# Altium schematic sheet Devel-AirScoutSchematics.SchDoc
size A2; SheetNumber: 1; SheetTotal: 2
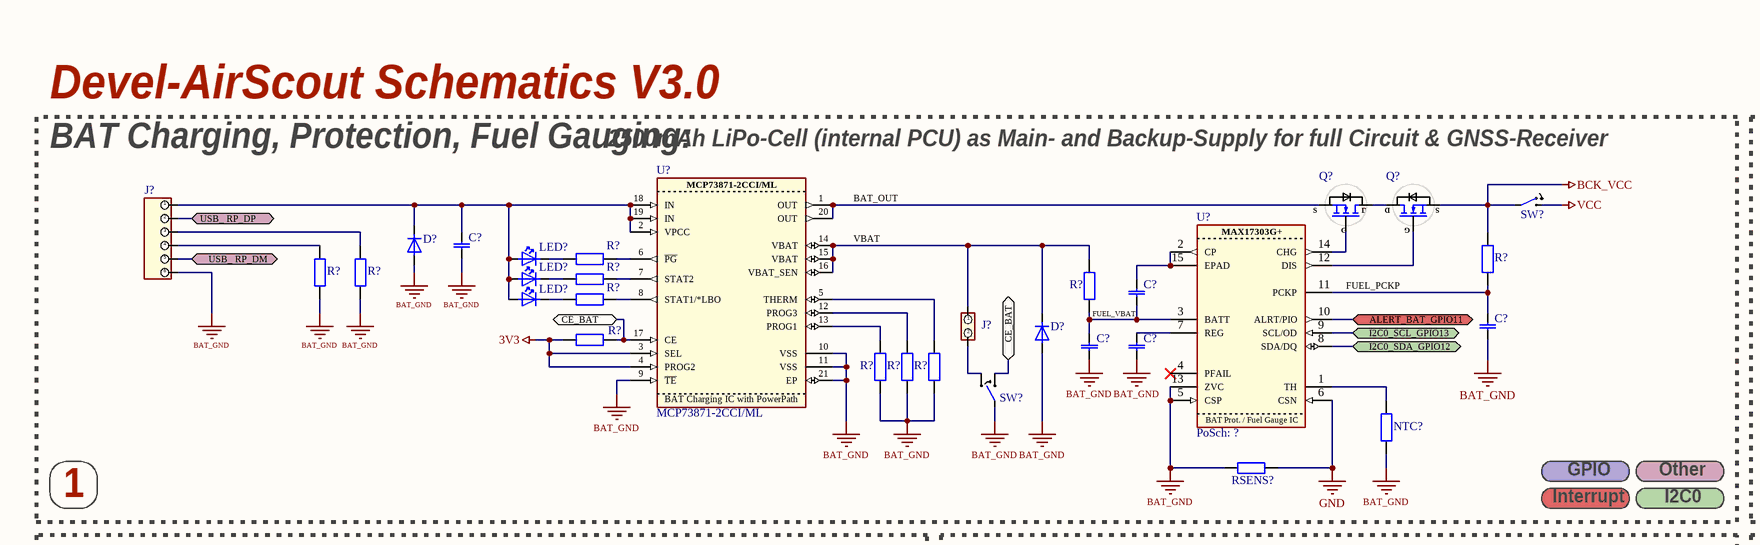
[diagram p0: Devel-AirScoutSchematics.SchDoc, top left]
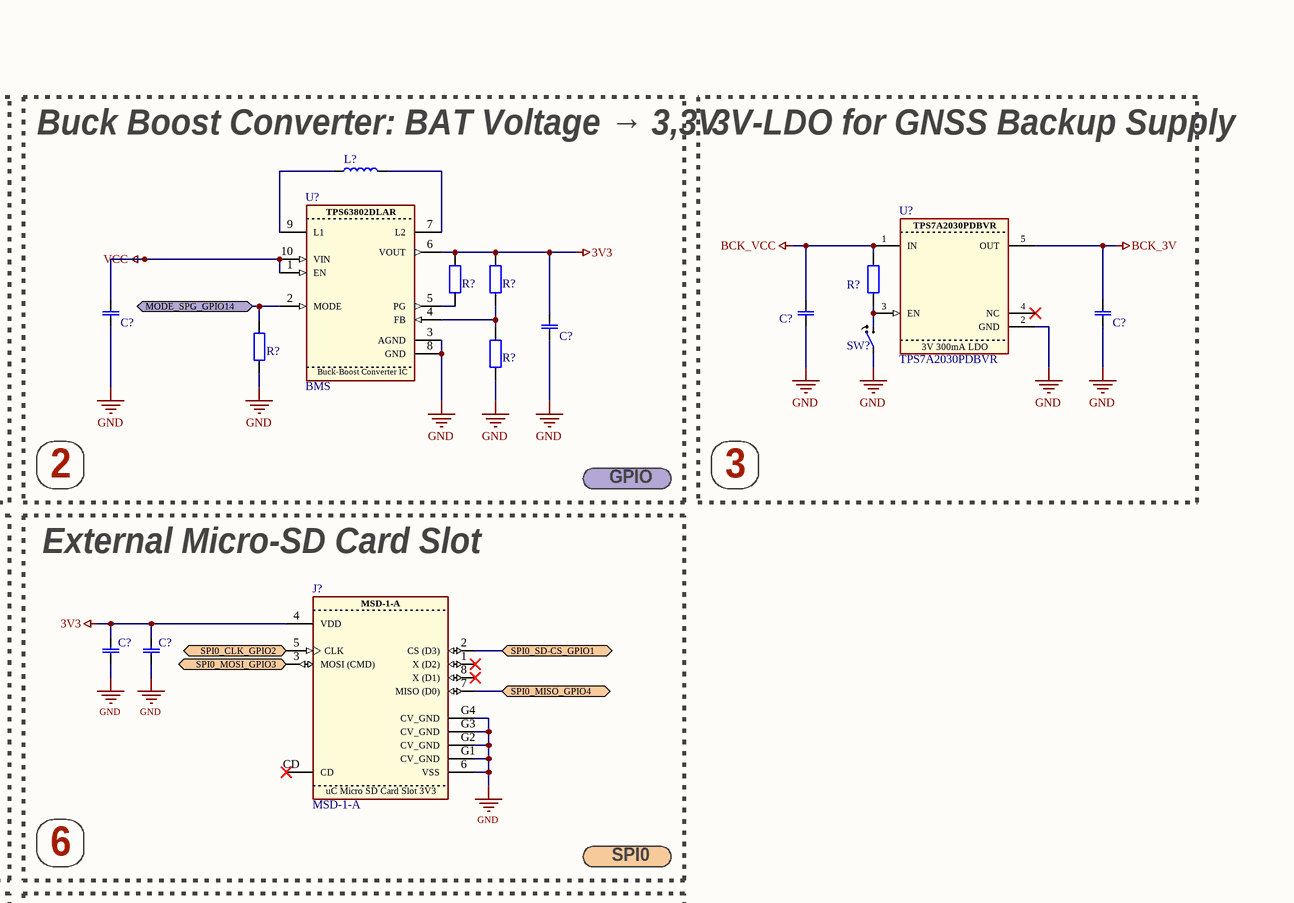
[diagram p1: Devel-AirScoutSchematics.SchDoc, top middle]
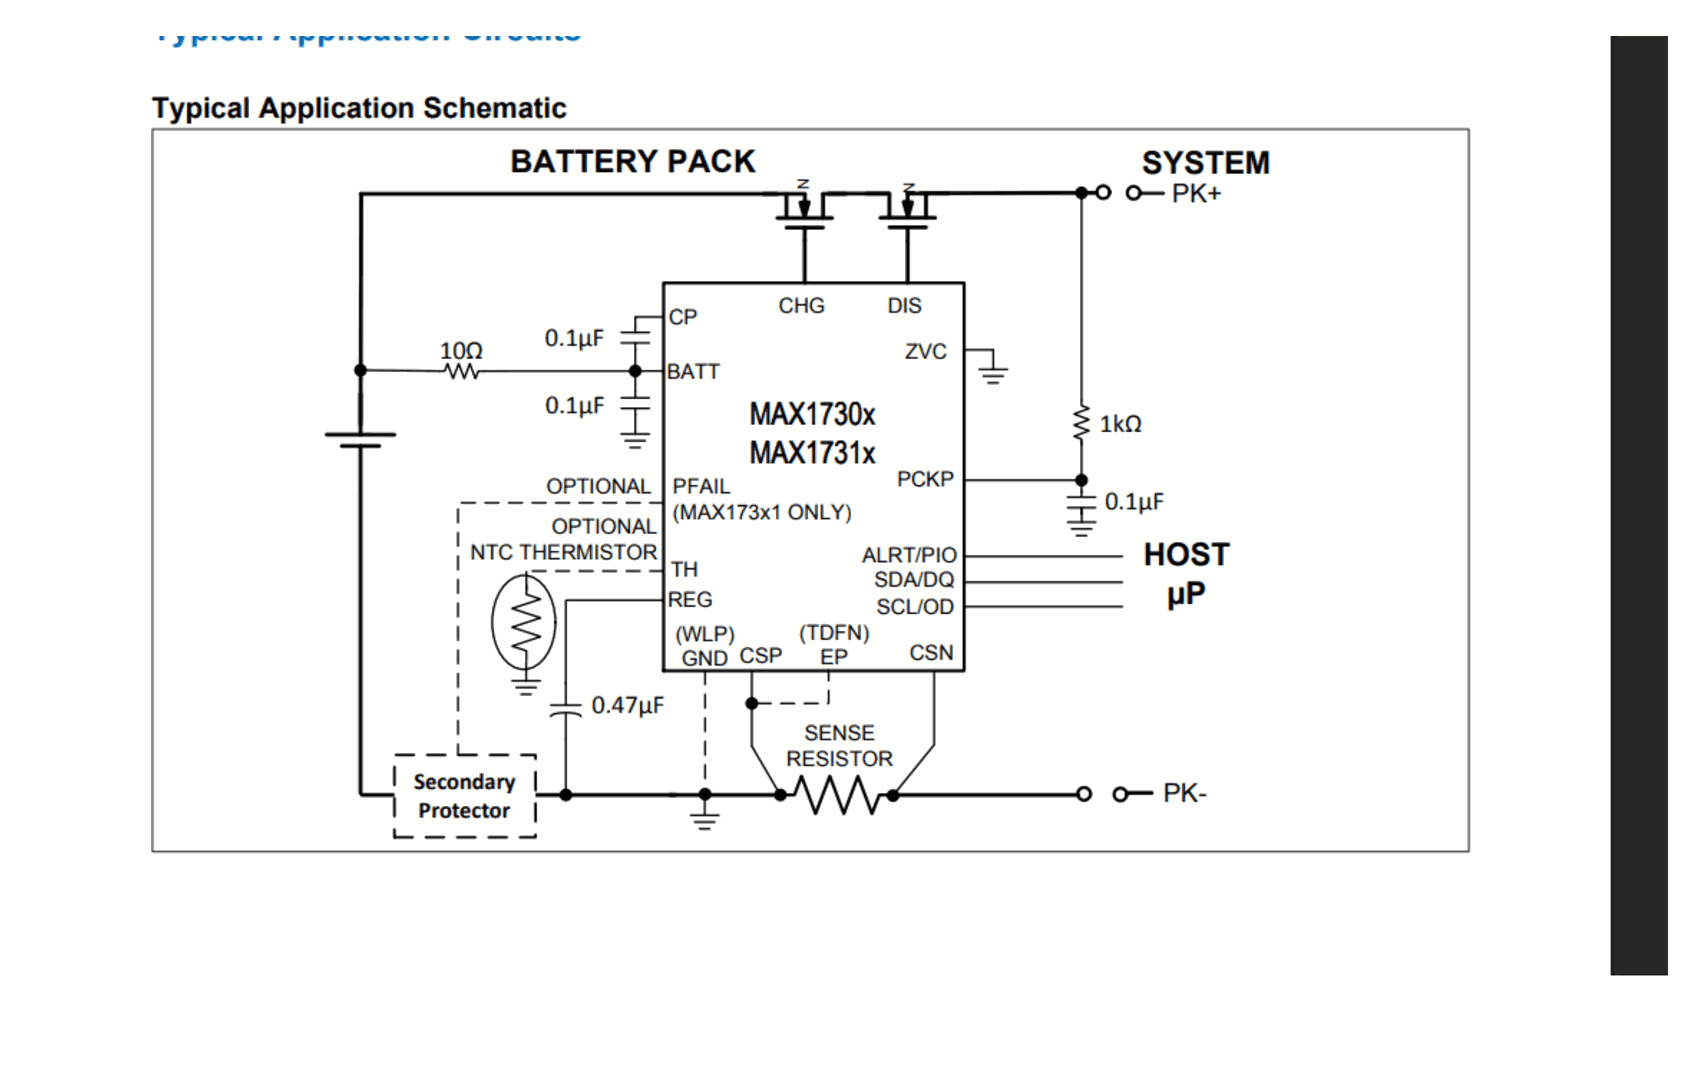
[diagram p2: Devel-AirScoutSchematics.SchDoc, top right]
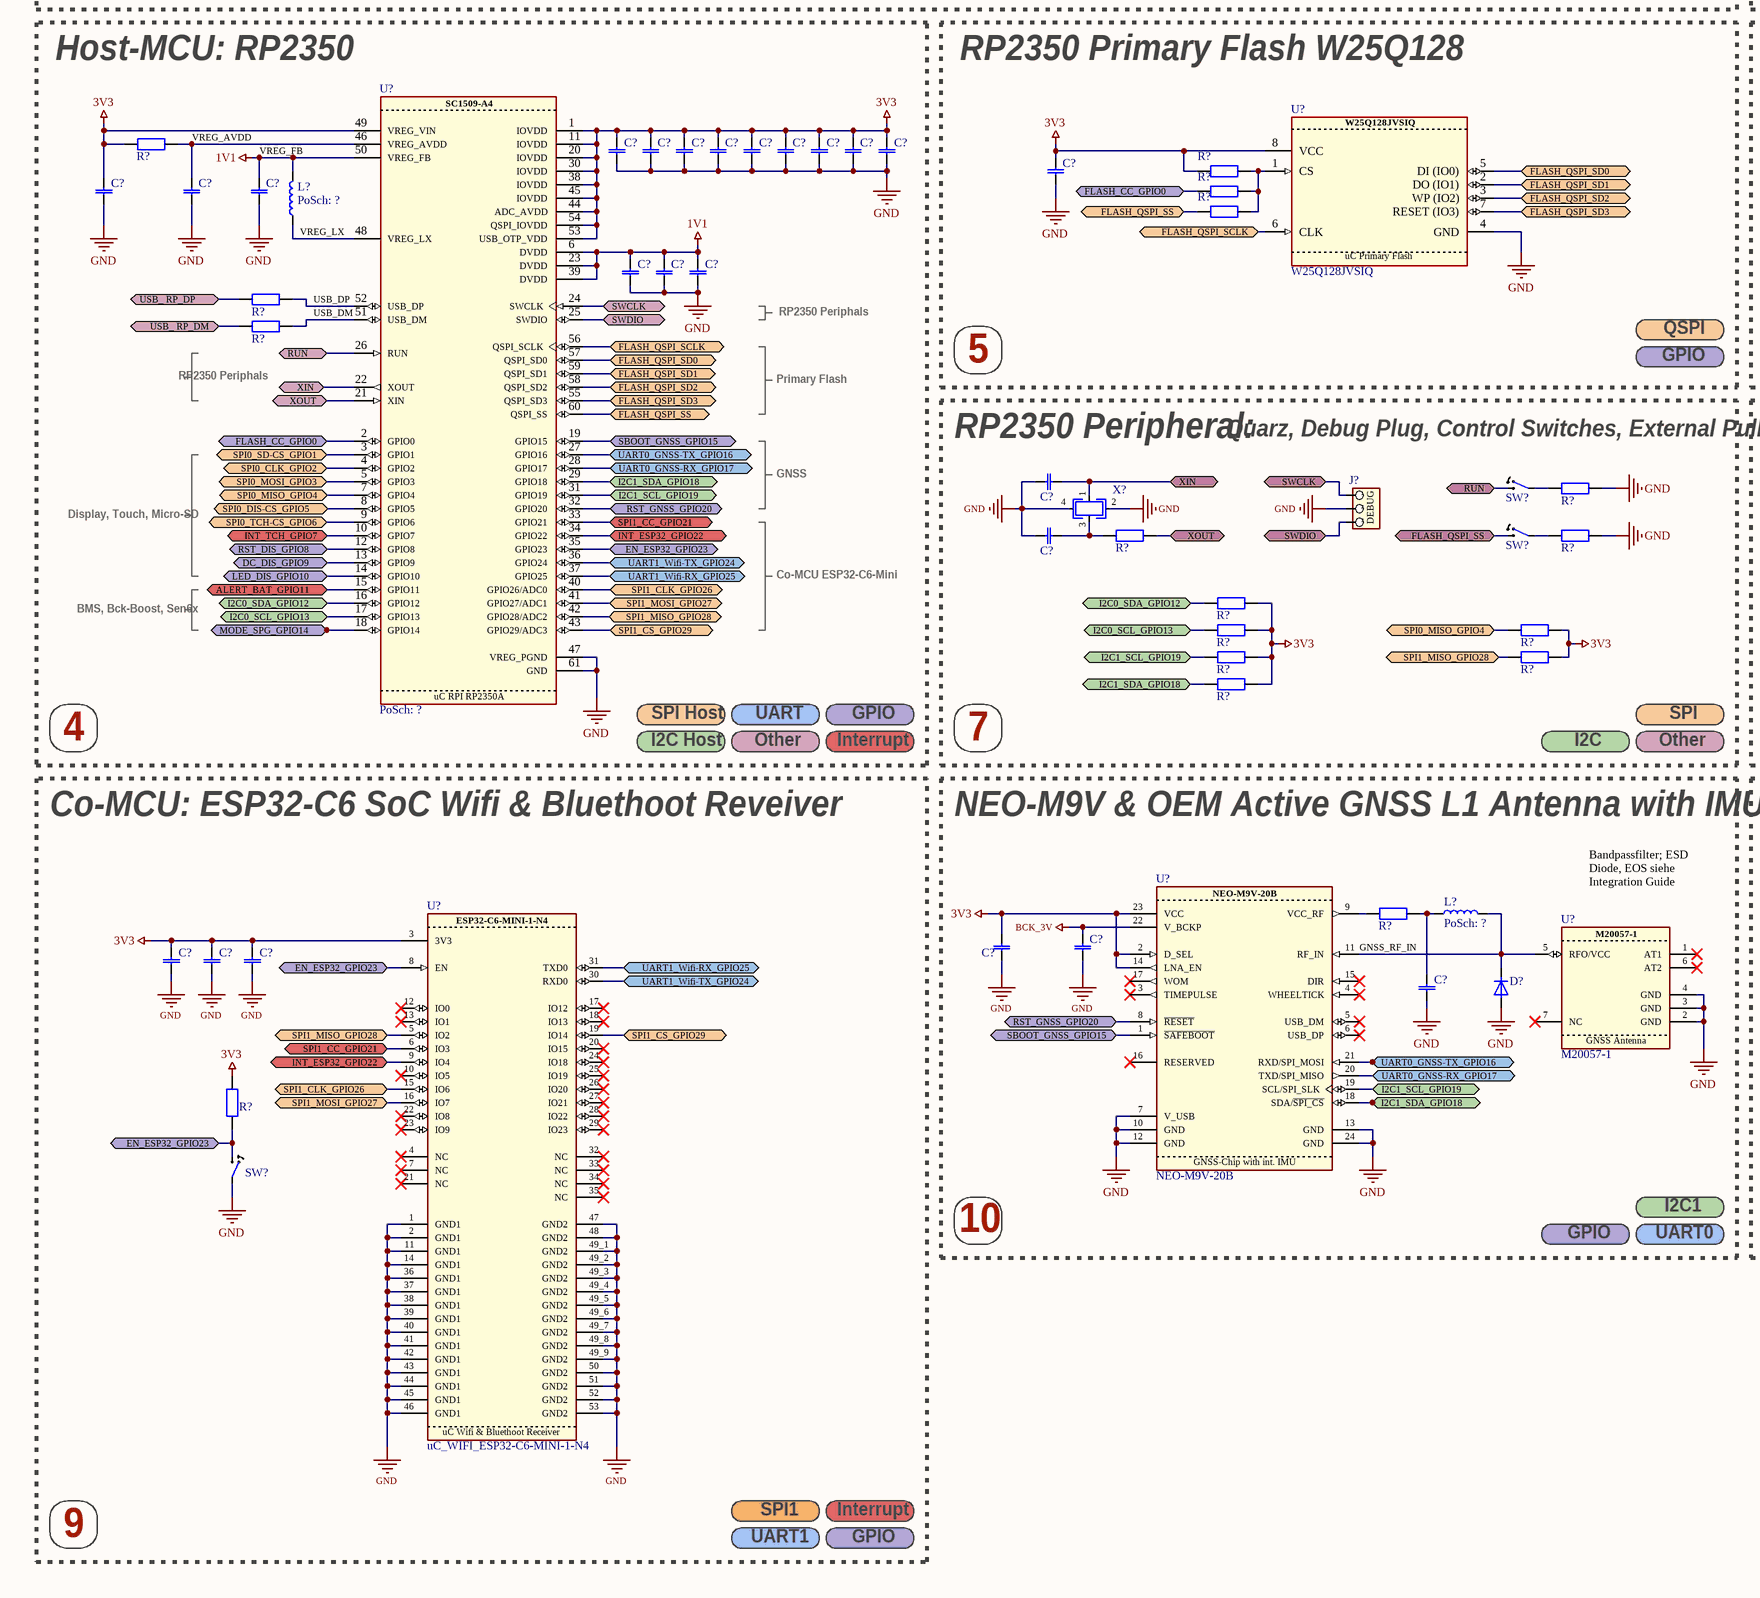
[diagram p3: Devel-AirScoutSchematics.SchDoc, bottom left]
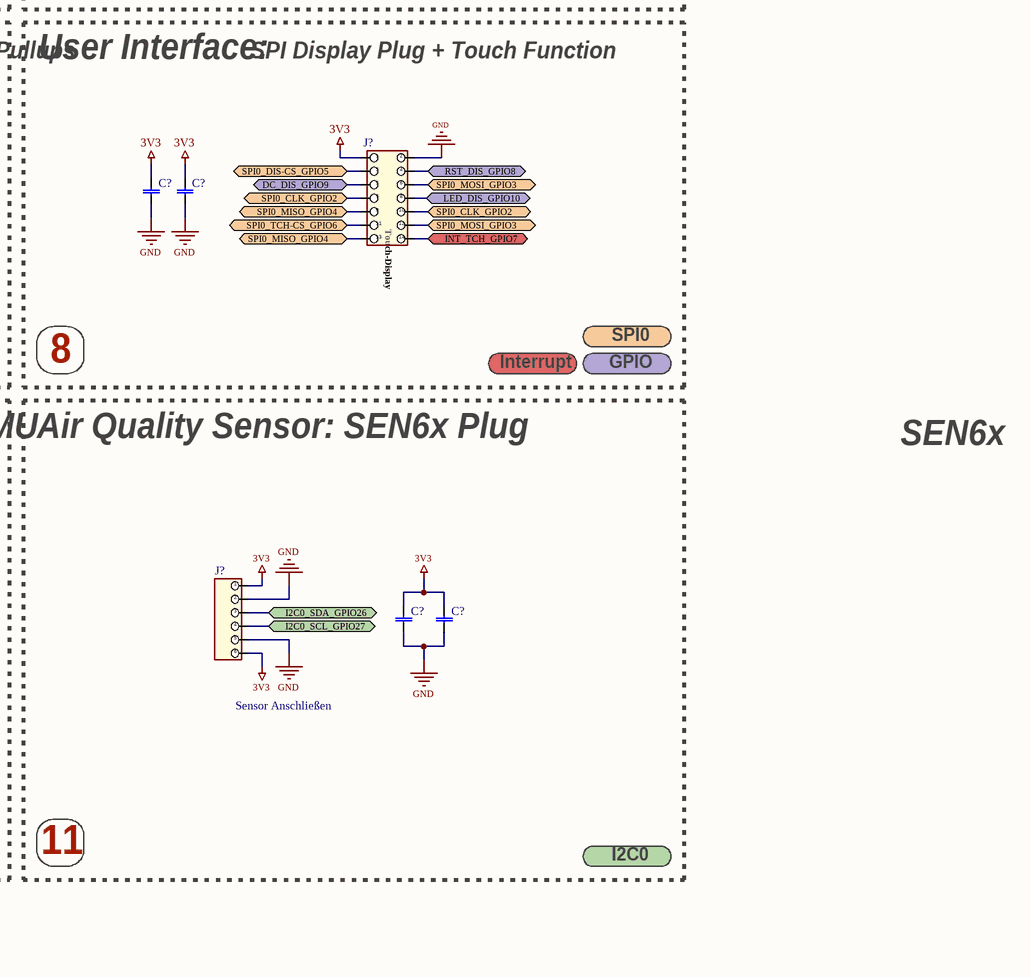
[diagram p4: Devel-AirScoutSchematics.SchDoc, bottom middle]

## Parts
(Parts that share a designator on the sheet are numbered #1, #2 ... from top to bottom, then left to right.)
C?#1  Capacitor with no polarity  [CAPC340180_140N_KEM]  (value not drawn)
C?#2  Capacitor with no polarity  [CAPC340180_140N_KEM]  (value not drawn)
C?#3  Capacitor with no polarity  [CAPC340180_140N_KEM]  (value not drawn)
C?#4  Capacitor with no polarity  [CAPC340180_140N_KEM]  (value not drawn)
C?#5  Capacitor with no polarity  [CAPC340180_140N_KEM]  (value not drawn)
C?#6  Capacitor with no polarity  [CAPC340180_140N_KEM]  (value not drawn)
C?#7  Capacitor with no polarity  [CAPC340180_140N_KEM]  (value not drawn)
C?#8  Capacitor with no polarity  [CAPC340180_140N_KEM]  (value not drawn)
C?#9  Capacitor with no polarity  [CAPC340180_140N_KEM]  (value not drawn)
C?#10  Capacitor with no polarity  [CAPC340180_140N_KEM]  (value not drawn)
C?#11  Capacitor with no polarity  [CAPC340180_140N_KEM]  (value not drawn)
C?#12  Capacitor with no polarity  [CAPC340180_140N_KEM]  (value not drawn)
C?#13  Capacitor with no polarity  [CAPC340180_140N_KEM]  (value not drawn)
C?#14  Capacitor with no polarity  [CAPC340180_140N_KEM]  (value not drawn)
C?#15  Capacitor with no polarity  [CAPC340180_140N_KEM]  (value not drawn)
C?#16  Capacitor with no polarity  [CAPC340180_140N_KEM]  (value not drawn)
C?#17  Capacitor with no polarity  [CAPC340180_140N_KEM]  (value not drawn)
C?#18  Capacitor with no polarity  [CAPC340180_140N_KEM]  (value not drawn)
C?#19  Capacitor with no polarity  [CAPC340180_140N_KEM]  (value not drawn)
C?#20  Capacitor with no polarity  [CAPC340180_140N_KEM]  (value not drawn)
C?#21  Capacitor with no polarity  [CAPC340180_140N_KEM]  (value not drawn)
C?#22  Capacitor with no polarity  [CAPC340180_140N_KEM]  (value not drawn)
C?#23  Capacitor with no polarity  [CAPC340180_140N_KEM]  (value not drawn)
C?#24  Capacitor with no polarity  [CAPC340180_140N_KEM]  (value not drawn)
C?#25  Capacitor with no polarity  [CAPC340180_140N_KEM]  (value not drawn)
C?#26  Capacitor with no polarity  [CAPC340180_140N_KEM]  (value not drawn)
C?#27  Capacitor with no polarity  [CAPC340180_140N_KEM]  (value not drawn)
C?#28  Capacitor with no polarity  [CAPC340180_140N_KEM]  (value not drawn)
C?#29  Capacitor with no polarity  [CAPC340180_140N_KEM]  (value not drawn)
C?#30  Capacitor with no polarity  [CAPC340180_140N_KEM]  (value not drawn)
C?#31  Capacitor with no polarity  [CAPC340180_140N_KEM]  (value not drawn)
C?#32  Capacitor with no polarity  [CAPC340180_140N_KEM]  (value not drawn)
C?#33  Capacitor with no polarity  [CAPC340180_140N_KEM]  (value not drawn)
C?#34  Capacitor with no polarity  [CAPC340180_140N_KEM]  (value not drawn)
C?#35  Capacitor with no polarity  [CAPC340180_140N_KEM]  (value not drawn)
C?#36  Capacitor with no polarity  [CAPC340180_140N_KEM]  (value not drawn)
C?#37  Capacitor with no polarity  [CAPC340180_140N_KEM]  (value not drawn)
C?#38  Capacitor with no polarity  [CAPC340180_140N_KEM]  (value not drawn)
C?#39  Capacitor with no polarity  [CAPC340180_140N_KEM]  (value not drawn)
D?#1  Diode; PN  (value not drawn)
D?#2  Diode; PN  (value not drawn)
D?#3  Diode; PN  (value not drawn)
J?#1  6 Plug in 1 Row  [JST_B6B-PH-K-S]  (value not drawn)
J?#2  PoSch: BMS  (value not drawn)
J?#3  MSD-1-A  [uC_MICROSDCON_MSD-1-A]
J?#4  3x1 vertical Connector Box  [CONN_3POL_SAMTEC]  (value not drawn)
J?#5  7 Plugs in 2 Rows  [CONN_14POL_SAMTEC]  (value not drawn)
J?#6  6 Plug in 1 Row  [JST_B6B-PH-K-S]  (value not drawn)
L?#1  PoSch: BMS  [IND_FDSD0420-H-100M=P3]  (value not drawn)
L?#2  PoSch: ?  [IND_FDSD0420-H-100M=P3]
L?#3  PoSch: ?  [IND_FDSD0420-H-100M=P3]
LED?#1  various color  [LED_LTST-C150GKT_LTO]  (value not drawn)
LED?#2  various color  [LED_LTST-C150GKT_LTO]  (value not drawn)
LED?#3  various color  [LED_LTST-C150GKT_LTO]  (value not drawn)
NTC?  Resistor of any value  [RESC3116X65N]  (value not drawn)
Q?#1  PoSch: BMS  (value not drawn)
Q?#2  PoSch: BMS  (value not drawn)
R?#1  Resistor of any value  [RESC3116X65N]  (value not drawn)
R?#2  Resistor of any value  [RESC3116X65N]  (value not drawn)
R?#3  Resistor of any value  [RESC3116X65N]  (value not drawn)
R?#4  Resistor of any value  [RESC3116X65N]  (value not drawn)
R?#5  Resistor of any value  [RESC3116X65N]  (value not drawn)
R?#6  Resistor of any value  [RESC3116X65N]  (value not drawn)
R?#7  Resistor of any value  [RESC3116X65N]  (value not drawn)
R?#8  Resistor of any value  [RESC3116X65N]  (value not drawn)
R?#9  Resistor of any value  [RESC3116X65N]  (value not drawn)
R?#10  Resistor of any value  [RESC3116X65N]  (value not drawn)
R?#11  Resistor of any value  [RESC3116X65N]  (value not drawn)
R?#12  Resistor of any value  [RESC3116X65N]  (value not drawn)
R?#13  Resistor of any value  [RESC3116X65N]  (value not drawn)
R?#14  Resistor of any value  [RESC3116X65N]  (value not drawn)
R?#15  Resistor of any value  [RESC3116X65N]  (value not drawn)
R?#16  Resistor of any value  [RESC3116X65N]  (value not drawn)
R?#17  RES, Resistor of any value  [RESC3116X65N]  (value not drawn)
R?#18  RES, Resistor of any value  [RESC3116X65N]  (value not drawn)
R?#19  RES, Resistor of any value  [RESC3116X65N]  (value not drawn)
R?#20  RES, Resistor of any value  [RESC3116X65N]  (value not drawn)
R?#21  RES, Resistor of any value  [RESC3116X65N]  (value not drawn)
R?#22  RES, Resistor of any value  [RESC3116X65N]  (value not drawn)
R?#23  RES, Resistor of any value  [RESC3116X65N]  (value not drawn)
R?#24  RES, Resistor of any value  [RESC3116X65N]  (value not drawn)
R?#25  RES, Resistor of any value  [RESC3116X65N]  (value not drawn)
R?#26  RES, Resistor of any value  [RESC3116X65N]  (value not drawn)
R?#27  RES, Resistor of any value  [RESC3116X65N]  (value not drawn)
R?#28  RES, Resistor of any value  [RESC3116X65N]  (value not drawn)
R?#29  RES, Resistor of any value  [RESC3116X65N]  (value not drawn)
R?#30  RES, Resistor of any value  [RESC3116X65N]  (value not drawn)
R?#31  RES, Resistor of any value  [RESC3116X65N]  (value not drawn)
R?#32  RES, Resistor of any value  [RESC3116X65N]  (value not drawn)
R?#33  RES, Resistor of any value  [RESC3116X65N]  (value not drawn)
RSENS?  Resistor of any value  [RESC3116X65N]  (value not drawn)
SW?#1  PoSch: ?  (value not drawn)
SW?#2  PoSch: ?  (value not drawn)
SW?#3  PoSch: ?  [SWITCH_2POS]  (value not drawn)
SW?#4  PoSch: ?  (value not drawn)
SW?#5  PoSch: ?  (value not drawn)
SW?#6  PoSch: ?  (value not drawn)
U?#1  PoSch: ?  [21-0137I_T1433-2_MXM]
U?#2  MCP73871-2CCI/ML  [BAT_LIN-CHARGE_MCP73871-2CCI/ML]
U?#3  BMS  [SPG_BCKBOOST_TPS63802DLAR]
U?#4  TPS7A2030PDBVR  [SPG_3V-LDO_TPS7A2030PDBVR]
U?#5  W25Q128JVSIQ  [uC_PRIMFLASH16MB_W25Q128JVSIQ]
U?#6  PoSch: ?  [uC_RP2350A_SC1509-A4_1]
U?#7  M20057-1  [GNSS_ANTENNA-MODULE_M20057-1]
U?#8  NEO-M9V-20B  [GNSS_RECEIVER-IMU_NEO-M9V-20B]
U?#9  uC_WIFI_ESP32-C6-MINI-1-N4  [uC_WIFI_ESP32-C6-MINI-1-N4]
X?  ABM8-272-T3  [uC_12MCRYSTAL_ABM8-272-T3_ABR]  (value not drawn)

## Blocks framed on the sheet
Devel-AirScout Schematics V3.0: C?#1-C?#3 C?#7 C?#8 D?#1 D?#2 J?#1 J?#2 LED?#1-LED?#3 NTC? Q?#1 Q?#2 R?#1-R?#7 R?#11-R?#14 RSENS? SW?#1 SW?#3 U?#1 U?#2
2: C?#4 C?#9 L?#1 R?#8 R?#9 R?#15 R?#16 U?#3
3: C?#5 C?#6 R?#10 SW?#2 U?#4
4: C?#10-C?#18 C?#22-C?#27 L?#2 R?#17 R?#21 R?#22 U?#6
5: C?#21 R?#18-R?#20 U?#5
6: C?#19 C?#20 J?#3
7: C?#28 C?#29 J?#4 R?#23-R?#31 SW?#4 SW?#5 X?
8: C?#30 C?#31 J?#5
9: C?#34-C?#36 R?#33 SW?#6 U?#9
10: C?#32 C?#33 C?#37 D?#3 L?#3 R?#32 U?#7 U?#8
11: C?#38 C?#39 J?#6

## Ports
ALERT_BAT_GPIO11 (bidir, see Devel-AirScoutSchematics[1C]), ALERT_BAT_GPIO11 (bidir, see Devel-AirScoutSchematics[4A]), CE_BAT (bidir, see Devel-AirScoutSchematics[2A]), CE_BAT (bidir, see Devel-AirScoutSchematics[3A]), DC_DIS_GPIO9 (bidir, see Devel-AirScoutSchematics[1C]), DC_DIS_GPIO9 (bidir, see Devel-AirScoutSchematics[6C]), EN_ESP32_GPIO23 (bidir, see Devel-AirScoutSchematics[1C], Devel-AirScoutSchematics[1D]), EN_ESP32_GPIO23 (bidir, see Devel-AirScoutSchematics[1C], Devel-AirScoutSchematics[2B]), EN_ESP32_GPIO23 (bidir, see Devel-AirScoutSchematics[1D], Devel-AirScoutSchematics[2B]), FLASH_CC_GPIO0 (bidir, see Devel-AirScoutSchematics[1B]), FLASH_CC_GPIO0 (bidir, see Devel-AirScoutSchematics[3B]), FLASH_QSPI_SCLK (bidir, see Devel-AirScoutSchematics[2B]), FLASH_QSPI_SCLK (bidir, see Devel-AirScoutSchematics[4B]), FLASH_QSPI_SD0 (bidir, see Devel-AirScoutSchematics[2B]), FLASH_QSPI_SD0 (bidir, see Devel-AirScoutSchematics[5B]), FLASH_QSPI_SD1 (bidir, see Devel-AirScoutSchematics[2B]), FLASH_QSPI_SD1 (bidir, see Devel-AirScoutSchematics[5B]), FLASH_QSPI_SD2 (bidir, see Devel-AirScoutSchematics[2B]), FLASH_QSPI_SD2 (bidir, see Devel-AirScoutSchematics[5B]), FLASH_QSPI_SD3 (bidir, see Devel-AirScoutSchematics[2B]), FLASH_QSPI_SD3 (bidir, see Devel-AirScoutSchematics[5B]), FLASH_QSPI_SS (bidir, see Devel-AirScoutSchematics[2B], Devel-AirScoutSchematics[3B]), FLASH_QSPI_SS (bidir, see Devel-AirScoutSchematics[2B], Devel-AirScoutSchematics[4B]), FLASH_QSPI_SS (bidir, see Devel-AirScoutSchematics[3B], Devel-AirScoutSchematics[4B]), I2C0_SCL_GPIO13 (bidir, see Devel-AirScoutSchematics[1C], Devel-AirScoutSchematics[3C]), I2C0_SCL_GPIO13 (bidir, see Devel-AirScoutSchematics[1C], Devel-AirScoutSchematics[4A]), I2C0_SCL_GPIO13 (bidir, see Devel-AirScoutSchematics[3C], Devel-AirScoutSchematics[4A]), I2C0_SCL_GPIO27 (bidir), I2C0_SDA_GPIO12 (bidir, see Devel-AirScoutSchematics[1C], Devel-AirScoutSchematics[3C]), I2C0_SDA_GPIO12 (bidir, see Devel-AirScoutSchematics[1C], Devel-AirScoutSchematics[4A]), I2C0_SDA_GPIO12 (bidir, see Devel-AirScoutSchematics[3C], Devel-AirScoutSchematics[4A]), I2C0_SDA_GPIO26 (bidir), I2C1_SCL_GPIO19 (bidir, see Devel-AirScoutSchematics[2B], Devel-AirScoutSchematics[3C]), I2C1_SCL_GPIO19 (bidir, see Devel-AirScoutSchematics[2B], Devel-AirScoutSchematics[4D]), I2C1_SCL_GPIO19 (bidir, see Devel-AirScoutSchematics[3C], Devel-AirScoutSchematics[4D]), I2C1_SDA_GPIO18 (bidir, see Devel-AirScoutSchematics[2B], Devel-AirScoutSchematics[3C]), I2C1_SDA_GPIO18 (bidir, see Devel-AirScoutSchematics[2B], Devel-AirScoutSchematics[4D]), I2C1_SDA_GPIO18 (bidir, see Devel-AirScoutSchematics[3C], Devel-AirScoutSchematics[4D]), INT_ESP32_GPIO22 (bidir, see Devel-AirScoutSchematics[1C]), INT_ESP32_GPIO22 (bidir, see Devel-AirScoutSchematics[2B]), INT_TCH_GPIO7 (bidir, see Devel-AirScoutSchematics[1B]), INT_TCH_GPIO7 (bidir, see Devel-AirScoutSchematics[6C]), LED_DIS_GPIO10 (bidir, see Devel-AirScoutSchematics[1C]), LED_DIS_GPIO10 (bidir, see Devel-AirScoutSchematics[6C]), MODE_SPG_GPIO14 (bidir, see Devel-AirScoutSchematics[1C]), MODE_SPG_GPIO14 (bidir, see Devel-AirScoutSchematics[6A]), RST_DIS_GPIO8 (bidir, see Devel-AirScoutSchematics[1B]), RST_DIS_GPIO8 (bidir, see Devel-AirScoutSchematics[6B]), RST_GNSS_GPIO20 (bidir, see Devel-AirScoutSchematics[2B]), RST_GNSS_GPIO20 (bidir, see Devel-AirScoutSchematics[3C]), RUN (bidir, see Devel-AirScoutSchematics[1B]), RUN (bidir, see Devel-AirScoutSchematics[4B]), SBOOT_GNSS_GPIO15 (bidir, see Devel-AirScoutSchematics[2B]), SBOOT_GNSS_GPIO15 (bidir, see Devel-AirScoutSchematics[3C]), SPI0_CLK_GPIO2 (bidir, see Devel-AirScoutSchematics[1B], Devel-AirScoutSchematics[6B], Devel-AirScoutSchematics[6C]), SPI0_CLK_GPIO2 (bidir, see Devel-AirScoutSchematics[1B], Devel-AirScoutSchematics[6C]), SPI0_CLK_GPIO2 (bidir, see Devel-AirScoutSchematics[6B], Devel-AirScoutSchematics[6C]), SPI0_DIS-CS_GPIO5 (bidir, see Devel-AirScoutSchematics[1B]), SPI0_DIS-CS_GPIO5 (bidir, see Devel-AirScoutSchematics[6B]), SPI0_MISO_GPIO4 (bidir, see Devel-AirScoutSchematics[1B], Devel-AirScoutSchematics[4C], Devel-AirScoutSchematics[6B], Devel-AirScoutSchematics[6C]), SPI0_MISO_GPIO4 (bidir, see Devel-AirScoutSchematics[1B], Devel-AirScoutSchematics[4C], Devel-AirScoutSchematics[6C]), SPI0_MISO_GPIO4 (bidir, see Devel-AirScoutSchematics[1B], Devel-AirScoutSchematics[6B], Devel-AirScoutSchematics[6C]), SPI0_MISO_GPIO4 (bidir, see Devel-AirScoutSchematics[4C], Devel-AirScoutSchematics[6B], Devel-AirScoutSchematics[6C]), SPI0_MOSI_GPIO3 (bidir, see Devel-AirScoutSchematics[1B], Devel-AirScoutSchematics[6B], Devel-AirScoutSchematics[6C]), SPI0_MOSI_GPIO3 (bidir, see Devel-AirScoutSchematics[1B], Devel-AirScoutSchematics[6C]), SPI0_MOSI_GPIO3 (bidir, see Devel-AirScoutSchematics[6B], Devel-AirScoutSchematics[6C]), SPI0_SD-CS_GPIO1 (bidir, see Devel-AirScoutSchematics[1B]), SPI0_SD-CS_GPIO1 (bidir, see Devel-AirScoutSchematics[6B]), SPI0_TCH-CS_GPIO6 (bidir, see Devel-AirScoutSchematics[1B]), SPI0_TCH-CS_GPIO6 (bidir, see Devel-AirScoutSchematics[6C]), SPI1_CC_GPIO21 (bidir, see Devel-AirScoutSchematics[1C]), SPI1_CC_GPIO21 (bidir, see Devel-AirScoutSchematics[2B]), SPI1_CLK_GPIO26 (bidir, see Devel-AirScoutSchematics[1D]), SPI1_CLK_GPIO26 (bidir, see Devel-AirScoutSchematics[2C]), SPI1_CS_GPIO29 (bidir, see Devel-AirScoutSchematics[2C]), SPI1_MISO_GPIO28 (bidir, see Devel-AirScoutSchematics[1C], Devel-AirScoutSchematics[2C]), SPI1_MISO_GPIO28 (bidir, see Devel-AirScoutSchematics[1C], Devel-AirScoutSchematics[4C]), SPI1_MISO_GPIO28 (bidir, see Devel-AirScoutSchematics[2C], Devel-AirScoutSchematics[4C]), SPI1_MOSI_GPIO27 (bidir, see Devel-AirScoutSchematics[1D]), SPI1_MOSI_GPIO27 (bidir, see Devel-AirScoutSchematics[2C]), SWCLK (bidir, see Devel-AirScoutSchematics[2B]), SWCLK (bidir, see Devel-AirScoutSchematics[4B]), SWDIO (bidir, see Devel-AirScoutSchematics[2B]), SWDIO (bidir, see Devel-AirScoutSchematics[4B]), UART0_GNSS-RX_GPIO17 (bidir, see Devel-AirScoutSchematics[2B]), UART0_GNSS-RX_GPIO17 (bidir, see Devel-AirScoutSchematics[4C]), UART0_GNSS-TX_GPIO16 (bidir, see Devel-AirScoutSchematics[2B]), UART0_GNSS-TX_GPIO16 (bidir, see Devel-AirScoutSchematics[4C]), UART1_Wifi-RX_GPIO25 (bidir, see Devel-AirScoutSchematics[2C]), UART1_Wifi-TX_GPIO24 (bidir, see Devel-AirScoutSchematics[2C]), USB_ RP_DM (bidir, see Devel-AirScoutSchematics[1A]), USB_ RP_DM (bidir, see Devel-AirScoutSchematics[1B]), USB_ RP_DP (bidir, see Devel-AirScoutSchematics[1A]), USB_ RP_DP (bidir, see Devel-AirScoutSchematics[1B]), XIN (bidir, see Devel-AirScoutSchematics[1B]), XIN (bidir, see Devel-AirScoutSchematics[4B]), XOUT (bidir, see Devel-AirScoutSchematics[1B]), XOUT (bidir, see Devel-AirScoutSchematics[4B])

## Nets
3V3: C?#9.2 C?#10.2 C?#11.2 C?#12.2 C?#13.2 C?#14.2 C?#15.2 C?#16.2 C?#17.2 C?#18.2 C?#19.2 C?#20.2 C?#21.2 C?#22.2 C?#30.2 C?#31.2 C?#32.2 C?#34.2 C?#35.2 C?#36.2 C?#38.2 C?#39.2 J?#3.4(VDD) J?#5.1 J?#6.1 J?#6.6 R?#8.2 R?#9.2 R?#11.1 R?#17.1 R?#18.2 R?#26.2 R?#27.2 R?#28.2 R?#29.2 R?#30.2 R?#31.2 R?#33.2 U?#2.3(SEL) U?#2.4(PROG2) U?#3.6(VOUT) U?#5.8(VCC) U?#6.1(IOVDD) U?#6.11(IOVDD) U?#6.20(IOVDD) U?#6.30(IOVDD) U?#6.38(IOVDD) U?#6.44(ADC_AVDD) U?#6.45(IOVDD) U?#6.49(VREG_VIN) U?#6.53(USB_OTP_VDD) U?#6.54(QSPI_IOVDD) U?#8.2(D_SEL) U?#8.14(LNA_EN) U?#8.23(VCC) U?#9.3(3V3)
BAT_GND: C?#1.1 C?#3.1 C?#7.1 C?#8.1 D?#1.1(A) D?#2.1(A) J?#1.6 NTC?.1 R?#3.1 R?#4.1 R?#12.1 R?#13.1 R?#14.1 RSENS?.1 SW?#3.2 U?#1.5(CSP) U?#1.13(ZVC) U?#2.9(~{TE}) U?#2.10(VSS) U?#2.11(VSS) U?#2.21(EP)
BCK_3V: C?#6.2 C?#33.2 U?#4.5(OUT) U?#8.22(V_BCKP)
BCK_VCC: C?#5.2 Q?#2.1(D) R?#2.2 R?#10.2 SW?#1.1 U?#4.1(IN)
GND: C?#4.1 C?#5.1 C?#6.1 C?#9.1 C?#10.1 C?#11.1 C?#12.1 C?#13.1 C?#14.1 C?#15.1 C?#16.1 C?#17.1 C?#18.1 C?#19.1 C?#20.1 C?#21.1 C?#22.1 C?#23.1 C?#24.1 C?#25.1 C?#26.1 C?#27.1 C?#28.2 C?#29.2 C?#30.1 C?#31.1 C?#32.1 C?#33.1 C?#34.1 C?#35.1 C?#36.1 C?#37.1 C?#38.1 C?#39.1 D?#3.1(A) J?#3.6(VSS) J?#3.G1(CV_GND) J?#3.G2(CV_GND) J?#3.G3(CV_GND) J?#3.G4(CV_GND) J?#4.2 J?#5.2 J?#6.2 J?#6.5 R?#15.1 R?#16.1 R?#23.2 R?#25.2 RSENS?.2 SW?#2.1 SW?#6.1 U?#1.6(CSN) U?#3.3(AGND) U?#3.8(GND) U?#4.2(GND) U?#5.4(GND) U?#6.47(VREG_PGND) U?#6.61(GND) U?#7.2(GND) U?#7.3(GND) U?#7.4(GND) U?#8.7(V_USB) U?#8.10(GND) U?#8.12(GND) U?#8.13(GND) U?#8.24(GND) U?#9.1(GND1) U?#9.2(GND1) U?#9.11(GND1) U?#9.14(GND1) U?#9.36(GND1) U?#9.37(GND1) U?#9.38(GND1) U?#9.39(GND1) U?#9.40(GND1) U?#9.41(GND1) U?#9.42(GND1) U?#9.43(GND1) U?#9.44(GND1) U?#9.45(GND1) U?#9.46(GND1) U?#9.47(GND2) U?#9.48(GND2) U?#9.49_1(GND2) U?#9.49_2(GND2) U?#9.49_3(GND2) U?#9.49_4(GND2) U?#9.49_5(GND2) U?#9.49_6(GND2) U?#9.49_7(GND2) U?#9.49_8(GND2) U?#9.49_9(GND2) U?#9.50(GND2) U?#9.51(GND2) U?#9.52(GND2) U?#9.53(GND2) X?.2 X?.4
VCC: C?#4.2 SW?#1.2 U?#3.1(EN) U?#3.10(VIN)
VREG_FB: C?#24.2 C?#25.2 C?#26.2 C?#27.2 L?#2.2 U?#6.6(DVDD) U?#6.23(DVDD) U?#6.39(DVDD) U?#6.50(VREG_FB)  [also labelled 1V1]
ALERT_BAT_GPIO11: U?#1.10(ALRT/PIO) U?#6.15(GPIO11) ; port ALERT_BAT_GPIO11
BAT_OUT: Q?#1.1(D) U?#2.1(OUT) U?#2.20(OUT)
CE_BAT: R?#11.2 SW?#3.3 U?#2.17(CE) ; port CE_BAT
DC_DIS_GPIO9: J?#5.5 U?#6.13(GPIO9) ; port DC_DIS_GPIO9
EN_ESP32_GPIO23: R?#33.1 SW?#6.2 U?#6.35(GPIO23) U?#9.8(EN) ; port EN_ESP32_GPIO23
FLASH_CC_GPIO0: R?#19.1 U?#6.2(GPIO0) ; port FLASH_CC_GPIO0
FLASH_QSPI_SCLK: U?#5.6(CLK) U?#6.56(QSPI_SCLK) ; port FLASH_QSPI_SCLK
FLASH_QSPI_SD0: U?#5.5(DI_(IO0)) U?#6.57(QSPI_SD0) ; port FLASH_QSPI_SD0
FLASH_QSPI_SD1: U?#5.2(DO_(IO1)) U?#6.59(QSPI_SD1) ; port FLASH_QSPI_SD1
FLASH_QSPI_SD2: U?#5.3(WP_(IO2)) U?#6.58(QSPI_SD2) ; port FLASH_QSPI_SD2
FLASH_QSPI_SD3: U?#5.7(RESET_(IO3)) U?#6.55(QSPI_SD3) ; port FLASH_QSPI_SD3
FLASH_QSPI_SS: R?#20.1 SW?#5.2 U?#6.60(QSPI_SS) ; port FLASH_QSPI_SS
FUEL_PCKP: C?#3.2 R?#2.1 U?#1.11(PCKP)
FUEL_VBAT: C?#2.1 C?#7.2 R?#6.1 U?#1.3(BATT)
GNSS_RF_IN: D?#3.2(K) L?#3.2 U?#7.5(RFO/VCC) U?#8.11(RF_IN)
I2C0_SCL_GPIO13: R?#27.1 U?#1.9(SCL/OD) U?#6.17(GPIO13) ; port I2C0_SCL_GPIO13
I2C0_SCL_GPIO27: J?#6.4 ; port I2C0_SCL_GPIO27
I2C0_SDA_GPIO12: R?#26.1 U?#1.8(SDA/DQ) U?#6.16(GPIO12) ; port I2C0_SDA_GPIO12
I2C0_SDA_GPIO26: J?#6.3 ; port I2C0_SDA_GPIO26
I2C1_SCL_GPIO19: R?#29.1 U?#6.31(GPIO19) U?#8.19(SCL/SPI_SLK) ; port I2C1_SCL_GPIO19
I2C1_SDA_GPIO18: R?#31.1 U?#6.29(GPIO18) U?#8.18(SDA/~{SPI_CS}) ; port I2C1_SDA_GPIO18
INT_ESP32_GPIO22: U?#6.34(GPIO22) U?#9.9(IO4) ; port INT_ESP32_GPIO22
INT_TCH_GPIO7: J?#5.14 U?#6.10(GPIO7) ; port INT_TCH_GPIO7
LED_DIS_GPIO10: J?#5.8 U?#6.14(GPIO10) ; port LED_DIS_GPIO10
MODE_SPG_GPIO14: R?#15.2 U?#3.2(MODE) U?#6.18(GPIO14) ; port MODE_SPG_GPIO14
RST_DIS_GPIO8: J?#5.4 U?#6.12(GPIO8) ; port RST_DIS_GPIO8
RST_GNSS_GPIO20: U?#6.32(GPIO20) U?#8.8(~{RESET}) ; port RST_GNSS_GPIO20
RUN: SW?#4.2 U?#6.26(RUN) ; port RUN
SBOOT_GNSS_GPIO15: U?#6.19(GPIO15) U?#8.1(~{SAFEBOOT}) ; port SBOOT_GNSS_GPIO15
SPI0_CLK_GPIO2: J?#3.5(CLK) J?#5.7 J?#5.10 U?#6.4(GPIO2) ; port SPI0_CLK_GPIO2
SPI0_DIS-CS_GPIO5: J?#5.3 U?#6.8(GPIO5) ; port SPI0_DIS-CS_GPIO5
SPI0_MISO_GPIO4: J?#3.7(MISO_(D0)) J?#5.9 J?#5.13 R?#28.1 U?#6.7(GPIO4) ; port SPI0_MISO_GPIO4
SPI0_MOSI_GPIO3: J?#3.3(MOSI_(CMD)) J?#5.6 J?#5.12 U?#6.5(GPIO3) ; port SPI0_MOSI_GPIO3
SPI0_SD-CS_GPIO1: J?#3.2(CS_(D3)) U?#6.3(GPIO1) ; port SPI0_SD-CS_GPIO1
SPI0_TCH-CS_GPIO6: J?#5.11 U?#6.9(GPIO6) ; port SPI0_TCH-CS_GPIO6
SPI1_CC_GPIO21: U?#6.33(GPIO21) U?#9.6(IO3) ; port SPI1_CC_GPIO21
SPI1_CLK_GPIO26: U?#6.40(GPIO26/ADC0) U?#9.15(IO6) ; port SPI1_CLK_GPIO26
SPI1_CS_GPIO29: U?#6.43(GPIO29/ADC3) U?#9.19(IO14) ; port SPI1_CS_GPIO29
SPI1_MISO_GPIO28: R?#30.1 U?#6.42(GPIO28/ADC2) U?#9.5(IO2) ; port SPI1_MISO_GPIO28
SPI1_MOSI_GPIO27: U?#6.41(GPIO27/ADC1) U?#9.16(IO7) ; port SPI1_MOSI_GPIO27
SWCLK: J?#4.1 U?#6.24(SWCLK) ; port SWCLK
SWDIO: J?#4.3 U?#6.25(SWDIO) ; port SWDIO
UART0_GNSS-RX_GPIO17: U?#6.28(GPIO17) U?#8.20(TXD/SPI_MISO) ; port UART0_GNSS-RX_GPIO17
UART0_GNSS-TX_GPIO16: U?#6.27(GPIO16) U?#8.21(RXD/SPI_MOSI) ; port UART0_GNSS-TX_GPIO16
UART1_Wifi-RX_GPIO25: U?#6.37(GPIO25) U?#9.31(TXD0) ; port UART1_Wifi-RX_GPIO25
UART1_Wifi-TX_GPIO24: U?#6.36(GPIO24) U?#9.30(RXD0) ; port UART1_Wifi-TX_GPIO24
USB_ RP_DM: J?#1.5 R?#22.1 ; port USB_ RP_DM
USB_ RP_DP: J?#1.2 R?#21.1 ; port USB_ RP_DP
USB_DM: R?#22.2 U?#6.51(USB_DM)
USB_DP: R?#21.2 U?#6.52(USB_DP)
VBAT: D?#2.2(K) J?#2.1(+) R?#6.2 U?#2.14(VBAT) U?#2.15(VBAT) U?#2.16(VBAT_SEN)
VREG_AVDD: C?#23.2 R?#17.2 U?#6.46(VREG_AVDD)
VREG_LX: L?#2.1 U?#6.48(VREG_LX)
XIN: C?#28.1 U?#6.22(XOUT) X?.1 ; port XIN
XOUT: R?#24.2 U?#6.21(XIN) ; port XOUT
NetC?#1_2: C?#1.2 D?#1.2(K) J?#1.1 LED?#1.1(A) LED?#2.1(A) LED?#3.1(A) U?#2.2(VPCC) U?#2.18(IN) U?#2.19(IN)
NetC?#2_2: C?#2.2 U?#1.2(CP) U?#1.15(EPAD)
NetC?#8_2: C?#8.2 U?#1.7(REG)
NetC?#29_1: C?#29.1 R?#24.1 X?.3
NetC?#37_2: C?#37.2 L?#3.1 R?#32.1
NetJ?#1_3: J?#1.3 R?#4.2
NetJ?#1_4: J?#1.4 R?#3.2
NetJ?#2_2: J?#2.2(-) SW?#3.1
NetL?#1_1: L?#1.1 U?#3.9(L1)
NetL?#1_2: L?#1.2 U?#3.7(L2)
NetLED?#1_2: LED?#1.2(K) R?#1.2
NetLED?#2_2: LED?#2.2(K) R?#5.2
NetLED?#3_2: LED?#3.2(K) R?#7.2
NetNTC?_2: NTC?.2 U?#1.1(TH)
NetQ?#1_2: Q?#1.2(G) U?#1.14(CHG)
NetQ?#1_3: Q?#1.3(S) Q?#2.3(S)
NetQ?#2_2: Q?#2.2(G) U?#1.12(DIS)
NetR?#1_1: R?#1.1 U?#2.6(~{PG})
NetR?#5_1: R?#5.1 U?#2.7(STAT2)
NetR?#7_1: R?#7.1 U?#2.8(STAT1/*LBO)
NetR?#8_1: R?#8.1 U?#3.5(PG)
NetR?#9_1: R?#9.1 R?#16.2 U?#3.4(FB)
NetR?#10_1: R?#10.1 SW?#2.2 U?#4.3(EN)
NetR?#12_2: R?#12.2 U?#2.13(PROG1)
NetR?#13_2: R?#13.2 U?#2.12(PROG3)
NetR?#14_2: R?#14.2 U?#2.5(THERM)
NetR?#18_1: R?#18.1 R?#19.2 R?#20.2 U?#5.1(CS)
NetR?#23_1: R?#23.1 SW?#4.1
NetR?#25_1: R?#25.1 SW?#5.1
NetR?#32_2: R?#32.2 U?#8.9(VCC_RF)

Not connected (* = marked no-connect by the designer): J?#3 1(X_(D2))* 8(X_(D1))* CD*; U?#1 4(PFAIL)*; U?#4 4(NC)*; U?#7 1(AT1)* 6(AT2)* 7(NC)*; U?#8 3(TIMEPULSE)* 4(WHEELTICK)* 5(USB_DM)* 6(USB_DP)* 15(DIR)* 16(RESERVED)* 17(WOM)*; U?#9 4(NC)* 7(NC)* 10(IO5)* 12(IO0)* 13(IO1)* 17(IO12)* 18(IO13)* 20(IO15)* 21(NC)* 22(IO8)* 23(IO9)* 24(IO18)* 25(IO19)* 26(IO20)* 27(IO21)* 28(IO22)* 29(IO23)* 32(NC)* 33(NC)* 34(NC)* 35(NC)*

## Notes on the sheet
- BAT Charging, Protection, Fuel Gauging:
- (near Q?#1) 2500mAh LiPo-Cell (internal PCU) as Main- and Backup-Supply for full Circuit & GNSS-Receiver
- (near L?#1) Buck Boost Converter: BAT Voltage → 3,3V
- 3V-LDO for GNSS Backup Supply
- 1
- Interrupt
- GPIO
- Other
- I2C0
- Host-MCU: RP2350
- RP2350 Primary Flash W25Q128
- External Micro-SD Card Slot
- RP2350 Periphals
- QSPI
- Primary Flash
- SPI0
- GNSS
- RP2350 Peripheral:
- Quarz, Debug Plug, Control Switches, External Pullups
- User Interface:
- SPI Display Plug + Touch Function
- Display, Touch, Micro-SD
- (near J?#4) DEBUG
- BMS, Bck-Boost, Sen6x
- Co-MCU ESP32-C6-Mini
- (near J?#5) Touch-Display
- I2C Host
- SPI Host
- UART
- I2C
- SPI
- Co-MCU: ESP32-C6 SoC Wifi & Bluethoot Reveiver
- NEO-M9V & OEM Active GNSS L1 Antenna with IMU
- Air Quality Sensor: SEN6x Plug
- SEN6x
- Bandpassfilter; ESD Diode, EOS siehe Integration Guide
- (near J?#6) Sensor Anschließen
- UART0
- I2C1
- UART1
- SPI1
- (in symbol BAT_LIN-CHARGE_MCP73871-2CCI/ML) BAT Charging IC with PowerPath
- (in symbol BAT_PROT+FUEL_MAX17303G+) BAT Prot. / Fuel Gauge IC
- (in symbol GNSS_ANTENNA-MODULE_M20057-1) GNSS Antenna
- (in symbol GNSS_RECEIVER-IMU_NEO-M9V-20B) GNSS-Chip with int. IMU
- (in symbol SPG_3V-LDO_TPS7A2030PDBVR) 3V 300mA LDO
- (in symbol SPG_BCKBOOST_TPS63802DLAR) Buck-Boost Converter IC
- (in symbol uC_MICROSDCON_MSD-1-A) uC Micro SD Card Slot 3V3
- (in symbol uC_PRIMFLASH16MB_W25Q128JVSIQ) uC Primary Flash
- (in symbol uC_RP2350A_SC1509-A4_1) uC RPI RP2350A
- (in symbol uC_WIFI_ESP32-C6-MINI-1-N4) uC Wifi & Bluethoot Receiver

## Library data of the parts
C?#1-C?#39 = CAP: This is an unpoled capacitor such as an ceramik or an Multi - Layer Cap. Put in here the description of your component.; Value: *
D?#1-D?#3 = Diode: Is used to block of current flow in one direction, Pay attetion to the maximum charactertcs
J?#1 J?#6 = CON6x1: This part is used to plug in cables or a siutable Plug . So in that way a connection can be achieved between boards.
J?#2 = CON2x1_vertical: PlugType: JST ''1.25mil; ComponentLink1Description: Datasheet Plug; ComponentLink1URL: *
J?#3 = uC_MICROSDCON_MSD-1-A: Micro SD Card Connector, 9 Positions, Connector and Ejector, Push In, Auto Eject Out, Surface Mount, 1.8 mm Height Above Board, Gold Flash; MF: Same Sky; SnapEDA_Link: https://www.snapeda.com/parts/MSD-1-A/Same+Sky/view-part/?ref=snap; Package: None; MP: MSD-1-A; Check_prices: https://www.snapeda.com/parts/MSD-1-A/Same+Sky/view-part/?ref=eda; Supplier 1: Arrow Electronics; Supplier Part Number 1: MSD-1-A; ComponentLink1Description: Datasheet; ComponentLink1URL: https://www.sameskydevices.com/product/resource/msd-1-a.pdf
J?#4 = CON 3x1: Can be used to create connectivity between two plates with cables or similar.
J?#5 = CON7x2: This part is used to plug in cables or a siutable Plug . So in that way a connection can be achieved between boards.
L?#1-L?#3 = Inductor: This is an inductor template for various sizes for inductors; Value: *
LED?#1-LED?#3 = LED: LED in diffrent colors
NTC? R?#1-R?#17 R?#21-R?#33 RSENS? = RES: Put in here the type and descriüption of your component; Value: *
Q?#1 Q?#2 = N-MOSFET: In this component, the parasitic diode is included because it plays an important rolw hen analysing networks; ComponentLink1Description: Datasheet; ComponentLink1URL: *
R?#18 R?#19 = RES: Put in here the type and descriüption of your component; Value: DNF
R?#20 = RES: Put in here the type and descriüption of your component; Value: 0
SW?#1 SW?#2 SW?#4-SW?#6 = Switch: 2 Postions (ON/OFF); ComponentLink1Description: Datasheet; ComponentLink1URL: *
SW?#3 = Switch_2POS: 2 Postions (1/2); ComponentLink1Description: Datasheet; ComponentLink1URL: *
U?#1 = BAT_PROT+FUEL_MAX17303G+: MAX17303G+; 1-Cell ModelGauge m5 EZ Fuel Gauge with Protector, Internal Self-Discharge Detection and SHA-256 Authentication; Manufacturer_Name: Analog Devices Inc; Copyright: Copyright (C) 2025 Ultra Librarian. All rights reserved.; Manufacturer_Part_Number: MAX17303G+; RefDes: RefDes; Type: Type; ComponentLink1Description: Datasheet; ComponentLink1URL: https://www.analog.com/media/en/technical-documentation/data-sheets/max17300-max17313.pdf; Case: 14-TDFN (3x3); Supplier 1: Farnell; Supplier Part Number 1: MAX17303G+
U?#2 = BAT_LIN-CHARGE_MCP73871-2CCI/ML: MCP73871-2CCI/ML; Charger IC Lithium Ion/Polymer 20-QFN (4x4); MF: Microchip Technology; Package: QFN-20 Microchip; Price: None; Check_prices: https://www.snapeda.com/parts/MCP73871-2CCI/ML/Microchip/view-part/?ref=eda; Value: *; SnapEDA_Link: https://www.snapeda.com/parts/MCP73871-2CCI/ML/Microchip/view-part/?ref=snap; MP: MCP73871-2CCI/ML; Availability: In Stock; Purchase-URL: https://pricing.snapeda.com/search/part/MCP73871-2CCI/ML/?ref=eda; Supplier 1: Farnell; Supplier Part Number 1: MCP73871-2CCI/ML; ComponentLink1Description: Datasheet; ComponentLink1URL: https://www.mouser.at/datasheet/3/282/1/MCP73871_Data_Sheet_DS20002090F.pdf
U?#3 = SPG_BCKBOOST_TPS63802DLAR: TPS63802DLARM; 2-A, high-efficient, 11-ÂµA quiescent current buck-boost converter in QFN/DFN package; MF: Texas Instruments; SnapEDA_Link: https://www.snapeda.com/parts/TPS63802DLAR/Texas+Instruments/view-part/?ref=snap; Package: VSON-HR-10 Texas Instruments; Case: 10-PowerVFDFN; MP: TPS63802DLAR; Check_prices: https://www.snapeda.com/parts/TPS63802DLAR/Texas+Instruments/view-part/?ref=eda; Supplier 1: DigiKey; Supplier Part Number 1: 296-TPS63802DLARDKR-ND; ComponentLink1Description: Datasheet; ComponentLink1URL: https://www.ti.com/lit/ds/symlink/tps63802.pdf
U?#4 = SPG_3V-LDO_TPS7A2030PDBVR: TPS7A2030PDBVR; 300mA ultra-low-noise low-IQ low-dropout (LDO) linear regulator with high PSRR 5-SOT-23 -40 to 125; Manufacturer_Name: Texas Instruments; TYPE: TYPE; RefDes: RefDes; Copyright: Copyright (C) 2026 Ultra Librarian. All rights reserved.; Manufacturer_Part_Number: TPS7A2030PDBVR; Supplier 1: DigiKey; Supplier Part Number 1: 296-TPS7A2030PDBVRCT-ND; ComponentLink1Description: Datasheet; ComponentLink1URL: https://www.ti.com/lit/ds/symlink/tps7a20.pdf?HQS=dis-dk-null-digikeymode-dsf-pf-null-wwe&ts=1786789473190
U?#5 = uC_PRIMFLASH16MB_W25Q128JVSIQ: W25Q128JVSIQ; IC FLASH 128MBIT SPI/QUAD 8SOIC; Manufacturer_Name: Winbond; Copyright: Copyright (C) 2026 Ultra Librarian. All rights reserved.; Manufacturer_Part_Number: W25Q128JVSIQ; RefDes: RefDes; Type: Type; Supplier 1: DigiKey; Supplier Part Number 1: W25Q128JVSIQ-ND; ComponentLink1Description: Datasheet; ComponentLink1URL: https://mm.digikey.com/Volume0/opasdata/d220001/medias/docus/7161/256_W25Q128JV.pdf
U?#6 = uC_RP2350A_SC1509-A4_1: RP2350; ARM® Cortex®-M33 - Mikrocontroller IC 32-Bit 150MHz Externer Programmspeicher 60-QFN (7x7); MF: Raspberry Pi; SnapEDA_Link: https://www.snapeda.com/parts/SC1509-A4/Raspberry+Pi/view-part/?ref=snap; Package: None; Case: 60-QFN (7x7); MP: SC1509-A4; Check_prices: https://www.snapeda.com/parts/SC1509-A4/Raspberry+Pi/view-part/?ref=eda; Supplier 1: DigiKey; Supplier Part Number 1: 2648-SC1509-A4DKR-ND; ComponentLink1Description: Datasheet; ComponentLink1URL: https://pip-assets.raspberrypi.com/categories/1214-rp2350/documents/RP-008373-DS-2-rp2350-datasheet.pdf
U?#7 = GNSS_ANTENNA-MODULE_M20057-1: M20057-1, 1.584GHz GNSS Chip RF Antenna 1.559GHz ~ 1.609GHz - Solder Surface Mount; MF: Antenova; SnapEDA_Link: https://www.snapeda.com/parts/M20057-1/Antenova/view-part/?ref=snap; Package: None; Value: *; MP: M20057-1; Check_prices: https://www.snapeda.com/parts/M20057-1/Antenova/view-part/?ref=eda; Supplier 1: Arrow Electronics; Supplier Part Number 1: M20057-1; ComponentLink1Description: Datasheet; ComponentLink1URL: https://www.antenova.com/active-gnss-module-m20057-1
U?#8 = GNSS_RECEIVER-IMU_NEO-M9V-20B: NEO-M9V-20B, NEO-M9V RF Receiver BeiDou, Galileo, GLONASS, GNSS, GPS 1.561GHz -160dBm Not Included; MF: u-blox; SnapEDA_Link: https://www.snapeda.com/parts/NEO-M9V-20B/u-blox/view-part/?ref=snap; Package: None; Value: *; MP: NEO-M9V-20B; Check_prices: https://www.snapeda.com/parts/NEO-M9V-20B/u-blox/view-part/?ref=eda; Supplier 1: DigiKey; Supplier Part Number 1: 672-NEO-M9V-20BCT-ND; ComponentLink1Description: Datasheet; ComponentLink1URL: https://content.u-blox.com/sites/default/files/NEO-M9V-20B_DataSheet_UBX-21029781.pdf
U?#9 = uC_WIFI_ESP32-C6-MINI-1-N4: ESP32-C6-MINI-1-N4; 802.15.4, Bluetooth, WiFi 802.11ax, Bluetooth v5.0, ZigbeeÂ® Transceiver Module 2.4GHz Antenna Not Included Surface Mount; MF: Espressif Systems; SnapEDA_Link: https://www.snapeda.com/parts/ESP32-C6-MINI-1-N4/Espressif+Systems/view-part/?ref=snap; Package: SMD-53 Espressif Systems; Value: *; MP: ESP32-C6-MINI-1-N4; Check_prices: https://www.snapeda.com/parts/ESP32-C6-MINI-1-N4/Espressif+Systems/view-part/?ref=eda
X? = uC_12MCRYSTAL_ABM8-272-T3: ABM8-272-T3; CRYSTAL 12.0000MHZ 10PF SMD; Manufacturer_Name: Abracon; Type: Crystals; Copyright: Copyright (C) 2026 Ultra Librarian. All rights reserved.; Manufacturer_Part_Number: ABM8-272-T3; RefDes: RefDes; ComponentLink1Description: Datasheet; ComponentLink1URL: https://abracon.com/datasheets/ABM8-272-T3.pdf; Supplier 1: Arrow Electronics; Supplier Part Number 1: ABM8-272-T3